# EAGLE design Adafruit OLED 128x32 Mono I2C STEMMA QT rev B (EAGLE 9.3.2)
COMPANY: ADAFRUIT INDUSTRIES; DRAWN: KTOWN; REV: A
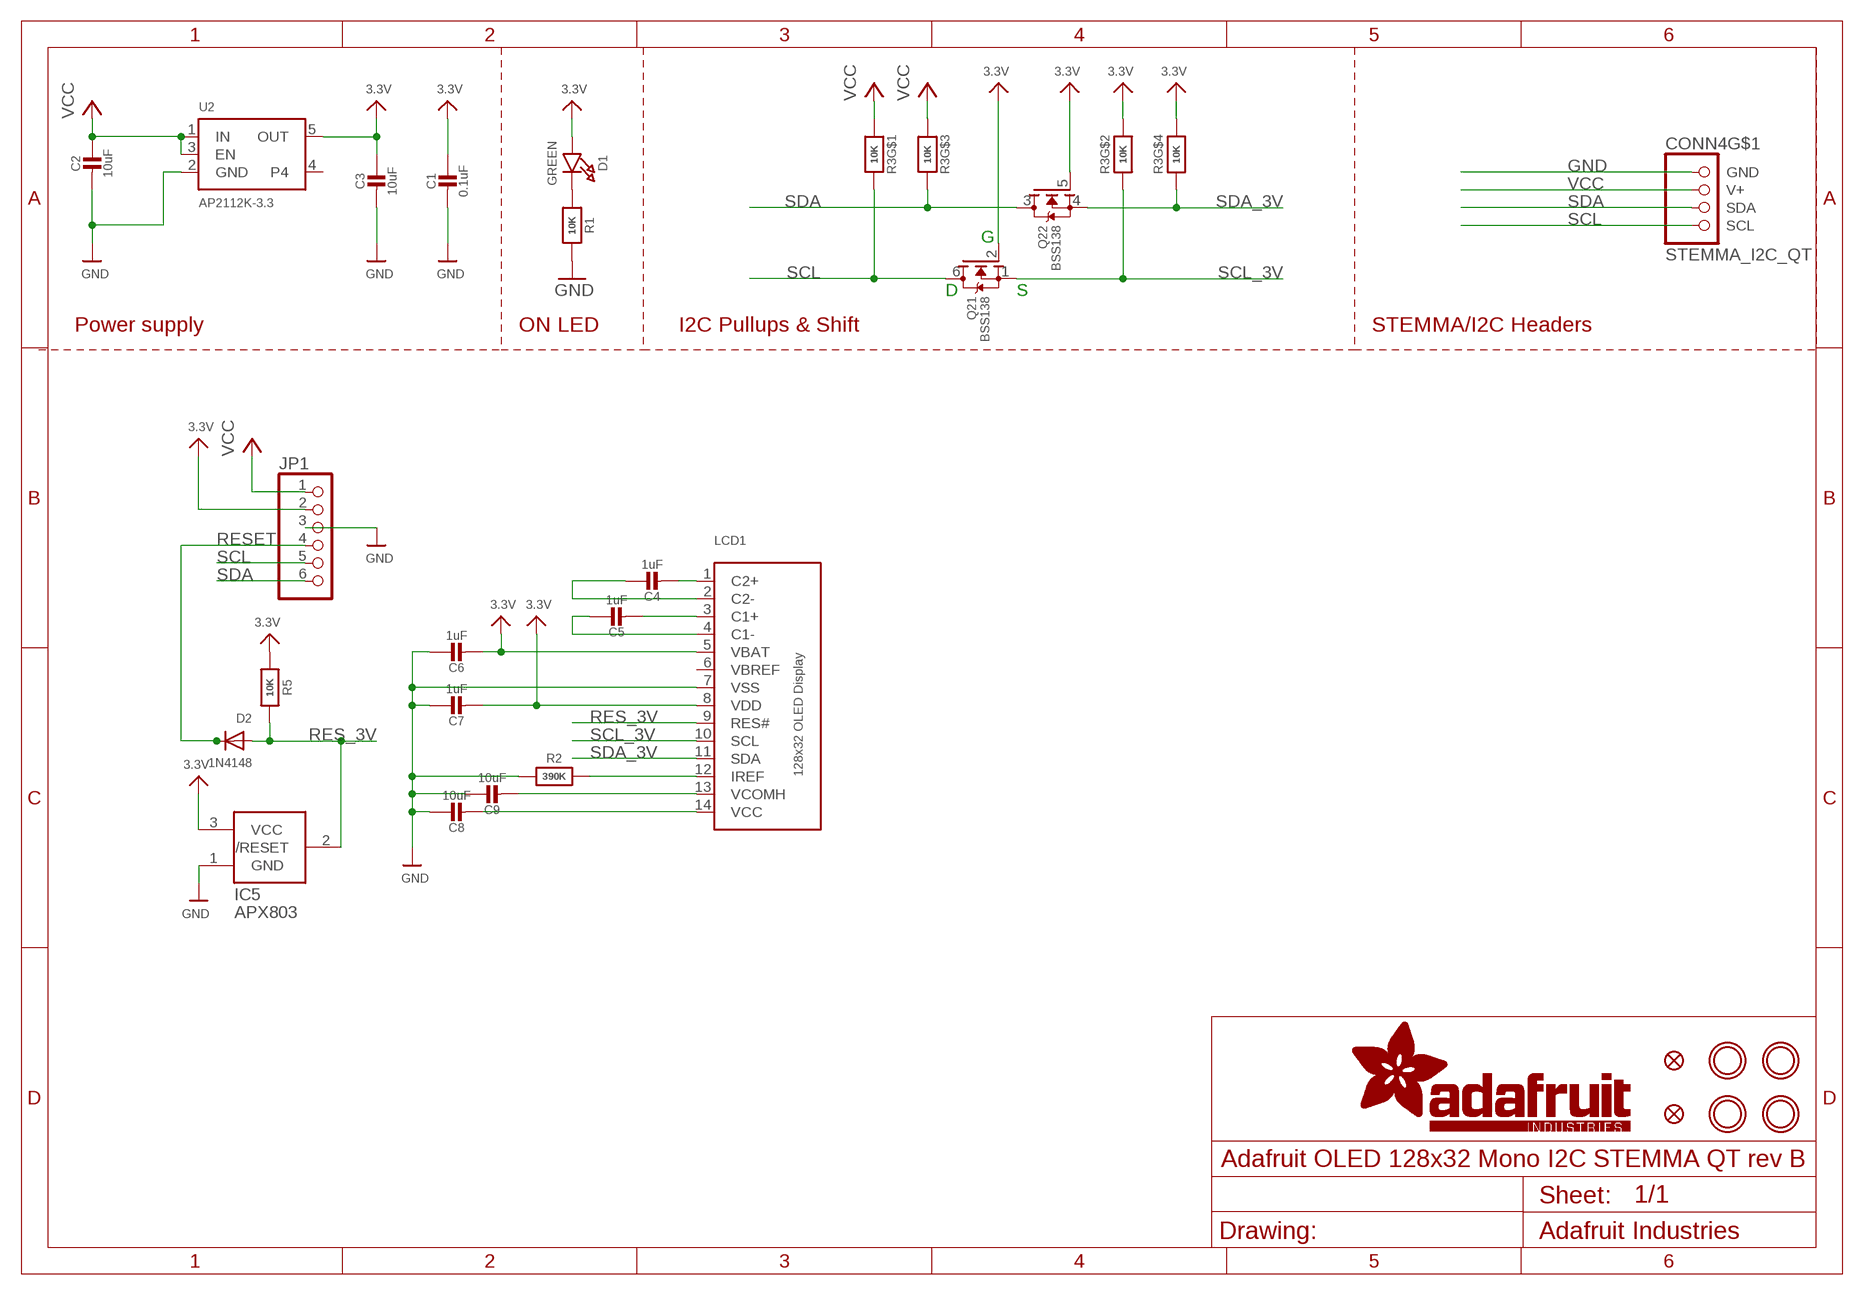
[diagram p0: schematic, sheet 1]

## Parts
C1  0.1uF  CAP_CERAMIC0603_NO  [0603-NO]
C2  10uF  CAP_CERAMIC0805-NOOUTLINE  [0805-NO]
C3  10uF  CAP_CERAMIC0805-NOOUTLINE  [0805-NO]
C4  1uF  CAP_CERAMIC0805-NOOUTLINE  [0805-NO]
C5  1uF  CAP_CERAMIC0805-NOOUTLINE  [0805-NO]
C6  1uF  CAP_CERAMIC0805-NOOUTLINE  [0805-NO]
C7  1uF  CAP_CERAMIC0805-NOOUTLINE  [0805-NO]
C8  10uF  CAP_CERAMIC0805-NOOUTLINE  [0805-NO]
C9  10uF  CAP_CERAMIC0805-NOOUTLINE  [0805-NO]
CONN4  STEMMA_I2C_QT  [JST_SH4]
D1  GREEN  LED0603_NOOUTLINE  [CHIPLED_0603_NOOUTLINE]
D2  1N4148  DIODESOD-323F  [SOD-323F]
FID3  FIDUCIAL_1MM  [FIDUCIAL_1MM]
FID4  FIDUCIAL_1MM  [FIDUCIAL_1MM]
IC5  APX803  AXP083-SAG  [SOT23]
JP1  HEADER-1X670MIL  [1X06_ROUND_70]
LCD1  DISP_OLED_UG-2832HSWEG02  [UG-2832HSWEG02_WRAPUNDER]
Q2  BSS138  MOSFET-N_DUAL  [SOT363]
R1  10K  RESISTOR_0603_NOOUT  [0603-NO]
R2  390K  RESISTOR_0603_NOOUT  [0603-NO]
R3  10K  RESISTOR_4PACK  [RESPACK_4X0603]
R5  10K  RESISTOR_0603_NOOUT  [0603-NO]
U2  AP2112K-3.3  VREG_SOT23-5  [SOT23-5]
U$1  MOUNTINGHOLE2.5  [MOUNTINGHOLE_2.5_PLATED]
U$17  MOUNTINGHOLE2.5  [MOUNTINGHOLE_2.5_PLATED]
U$19  MOUNTINGHOLE2.5  [MOUNTINGHOLE_2.5_PLATED]
U$21  MOUNTINGHOLE2.5  [MOUNTINGHOLE_2.5_PLATED]

## Nets
3.3V: C1.1 C3.1 C6.2 C7.2 D1.A IC5.3(VCC) JP1.2 LCD1.5(VBAT) LCD1.8(VDD) Q2.2(1:G) Q2.5(2:G) R3.2 R3.4 R5.2 U2.5(OUT)
GND: C1.2 C2.2 C3.2 C6.1 C7.1 C8.1 C9.1 CONN4.1(GND) IC5.1(GND) JP1.3 LCD1.7(VSS) R1.2 R2.1 U2.2(GND)
N$1: C4.2 LCD1.1(C2+)
N$2: D1.C R1.1
N$3: C4.1 LCD1.2(C2-)
N$4: C5.2 LCD1.3(C1+)
N$5: C5.1 LCD1.4(C1-)
N$6: C9.2 LCD1.13(VCOMH)
N$7: LCD1.12(IREF) R2.2
N$8: C8.2 LCD1.14(VCC)
RES_3V: D2.A IC5.2(/RESET) LCD1.9(RES#) R5.1
RESET: D2.C JP1.4
SCL: CONN4.4(SCL) JP1.5 Q2.6(1:D) R3.8
SCL_3V: LCD1.10(SCL) Q2.1(1:S) R3.7
SDA: CONN4.3(SDA) JP1.6 Q2.3(2:D) R3.6
SDA_3V: LCD1.11(SDA) Q2.4(2:S) R3.5
VCC: C2.1 CONN4.2(V+) JP1.1 R3.1 R3.3 U2.1(IN) U2.3(EN)
Unconnected: CONN4.MT1(MT) CONN4.MT2(MT) U2.4

## Notes on the sheet
- G
- D | S
- Power supply | ON LED | I2C Pullups & Shift | STEMMA/I2C Headers

## Power pins joined to a net without a drawn wire
VBREF: LCD1.6(VBREF)

## Library data of the parts
C1-C9 = microbuilder:CAP_CERAMIC: Ceramic Capacitors For new designs, use the packages preceded by an '_' character since they are more reliable: The following footprints should be used on most boards: _0402 - Standard footprint for regular board layouts _0603 - Standard footprint for regular board layouts _0805 - Standard footprint for regular board layouts _1206 - Standard footprint for regular board layouts For extremely tight-pitch boards where space is at a premium, the following 'micro-pitch' footprints can be used (smaller pads, no silkscreen outline, etc.): _0402MP - Micro-pitch footprint for very dense/compact boards _0603MP - Micro-pitch footprint for very dense/compact boards _0805MP - Micro-pitch footprint for very dense/compact boards _1206MP - Micro-pitch footprint for very dense/compact boards
CONN4 = microbuilder:STEMMA_I2C
D1 = microbuilder:LED: LED 0603 - 0603 Surface Mount Package 2mA: Green LED - Low Power (3.9mcd, 2ma, 1.7Vf) - Digikey: 475-2709-2-ND Orange LED - Low Power (9.8mcd, 2ma, 1.8Vf) - Digikey: 475-1194-2-ND Red LED - Low Power (5mcd, 2ma, 1.8Vf) - Digikey: 475-1195-2-ND Yellow LED - Low Power (7mcd, 2ma, 1.8Vf) - Digikey: 475-1196-2-ND 5mA: Blue LED - Low Power (17mcd, 5ma, 2.9Vf) - Digikey: LNJ937W8CRACT-ND 0805 - 0805 Surface Mount Package 2mA: Red LED (8.8mcd, 2mA, 1.8Vf, Clear) - Low Power [Digikey: 475-2510-1-ND] Green LED (5mcd, 2mA, 1.8Vf, Clear) - Low Power [Digikey: 475-2730-1-ND] Yellow LED (11.3mcd, 2mA, 1.8Vf, Clear) - Low Power [Digikey: 475-2555-1-ND] 20mA: Red LED (104mcd, 20mA, Diffused) - LS R976 [Digikey: 475-1278-6-ND] Red LED (12mcd, 20mA, 2.0Vf, Clear) - APT2012EC [Digikey: 754-1128-1-ND] Green LED (15mcd, 20mA, 2.2Vf, Clear) - APT2012GC [Digikey: 754-1131-1-ND] Orange LED (160mcd, 20mA, 2.1Vf, Clear) - APT2012SECK [Digikey: 754-1130-1-ND] 1206 - 1206 Surface Mount Package Green LED (26mcd, 20mA, Diffused) - LG N971 [Digikey: 475-1407-6-ND] Red LED (15mcd, 20mA, Diffused) - LH N974 [Digikey: 475-1416-6-ND] Cree - Cree High-Power Surface Mount LEDs XPEBWT-L1-0000-00D50 - White 111lm 350mA 2.9Vf 6200K 110° XTEAWT-00-0000-00000LEE3 - White 114lm 350mA 2.85Vf 5000K 115° Everlight - Everlight 45-21 Series Surface Mount LEDs 45-21/QK2C-B2832AC2CB2/2T - Warm White 2000mcd 20mA 3.25Vf 3050K 120° 45-21/LK2C-B38452C4CB2/2T - Nuetral White 2000mcd 20mA 3.25Vf 4150K 120° 45-21/LK2C-B50634C6CB2/2T - Cold White 2200mcd 20mA 3.25Vf 5650K 120° PLCC2 Reverse Mount LS T77K-J1L2-1-0-2-R18-Z - Red 11.25mcd 2mA 1.8Vf 630nm 120° LO T77K-L1M2-24-Z - Orange 19.6mcd 2mA 1.8Vf 606nm 120° LY T77K-K2M1-26-Z - Yellow 15.7mcd 2mA 1.8Vf 587nm 120°
D2 = adafruit:DIODE: Diode SMADIODE - SMA Surface Mount Package 20V 1A Schottky Diode Digikey: 641-1014-6-ND DO-1N4148 - Through Hole Small Current Diode SOD-123 20V 1 A (.5mV Vf) Schottky Diode - Digikey: MBRX120TPMSCT-ND SOD-323 10V 570mA (.38mV Vf, 3ns) Schottky Diode - Digikey: ZLLS410CT-ND SOD-523 30V 30mA Schottky Diode (RB751S-40TE61) - Digikey: RB751S-40TE61CT-ND SOT23-R/W - SOT23 Package (R = Solder Paste/Reflow Ovens, W = Hand-Soldering) BAT54Film 40V 300mA - Digikey: 497-7162-1-ND
FID3 FID4 = microbuilder:FIDUCIAL: Fiducial Alignment Points Various fiducial points for machine vision alignment.; BOM: EXCLUDE
IC5 = adafruit:AXP083
JP1 = microbuilder:HEADER-1X6: PIN HEADER
LCD1 = microbuilder:DISP_OLED_UG-2832HSWEG02: 128x32 I2C 0.91" Monochrome OLED Display
Q2 = microbuilder:MOSFET-N_DUAL: Dual N-Channel MOSFET SOT363 (2.0x1.25mm) 2N7002PS - 60V, 320mA [Digikey: 568-5984-1-ND]
R1 R2 R5 = microbuilder:RESISTOR: Resistors For new designs, use the packages preceded by an '_' character since they are more reliable: The following footprints should be used on most boards: _0402 - Standard footprint for regular board layouts _0603 - Standard footprint for regular board layouts _0805 - Standard footprint for regular board layouts _1206 - Standard footprint for regular board layouts For extremely tight-pitch boards where space is at a premium, the following 'micro-pitch' footprints can be used (smaller pads, no silkscreen outline, etc.): _0402MP - Micro-pitch footprint for very dense/compact boards _0603MP - Micro-pitch footprint for very dense/compact boards _0805MP - Micro-pitch footprint for very dense/compact boards _1206MP - Micro-pitch footprint for very dense/compact boards
R3 = microbuilder:RESISTOR_4PACK: Resistor Packs (4 resistors) 4 x 0603 10K 1/16W - Digikey: YC164J-10KCT-ND
U2 = microbuilder:VREG_SOT23-5: SOT23-5 Fixed Voltage Regulators Part Current Out V Out V In V Dropout θJA (°C/W) TJ (°C) Digikey Part No. ADP121 150mA 3.3V 3.4-5.5V 0.09V @ 150mA -- -- ADP121-AUJZ33R7CT-ND ADP121 150mA 3.0V 3.1-5.5V 0.09V @ 150mA -- -- ADP121-AUJZ30R7CT-ND ADP122 300mA 3.3V 3.4-5.5V 0.085V @ 300mA -- -- ADP122AUJZ-3.3-R7CT-ND ADP1712 300mA 3.3V 3.5-5.5V 0.17V @ 300mA -- -- ADP1712AUJZ-3.3-R7TR-ND AP7311 (Low Cost) 150mA 3.3V 3.5-6V 0.15V @ 150mA -- -- AP7311-33WG-7DICT-ND LD39015M18R 150mA 1.8V 1.9V-5.5V 0.08V @ 100mA -- -- 497-6977-1-ND LP2985A-33DBVR 150mA 3.3V 3.3-16V 0.28V @ 150mA 206 150 296-18479-1-ND MCP1824T-3302E/OT 300mA 3.3V 3.5V-6V 0.2V @ 300mA -- -- MCP1824T-3302E/OTCT-ND MIC5205-2.5YM5 TR 150mA 2.5V 2.7-16V 0.165V @ 150mA -- -- 576-1257-2-ND MIC5205-3.0YM5 TR 150mA 3.0V 3.2V-16V 0.165V @ 150mA -- -- 576-1258-2-ND MIC5205-3.3YM5 TR 150mA 3.3V 3.5V-16V 0.165V @ 150mA -- -- 576-1259-2-ND TPS780330220 150mA 3.3V+2.2V 3.6-5.5V 250mV Max -- -- 296-23332-1-ND TDA3663/N1,135 100mA 3.3V 3.5-45V 0.18V @ 50mA -- -- 568-5343-1-ND Max operating temp can be calculated using θJA, TJ (max junction temperature), and power in watts. Set the "Maximum Ambient Temperature" until it reaches TJ ("Max Junction Temperature"), which is the absolute limit for safe use of the regulator: Heat Sink Temperature Calculator <http://www.daycounter.com/Calculators/Heat-Sink-Temperature-Calculator.phtml> For example, With 12V source into a 3.3V LP2985 and a 30mA load, we are dissipating (12V-3.3V) * 0.03A = 0.261W. With a θJA of 206 °C/W, a TJ of 150°C, and 261mW we can safely use the chip without a heat sink up to 75°C (=147.1°C Junction Temperature).
U$1 U$17 U$19 U$21 = microbuilder:MOUNTINGHOLE: Mounting Hole For #2 screws (0.086"/2.18mm width, 0.094"/2.4mm hole) use 2.5mm; BOM: EXCLUDE

## Board
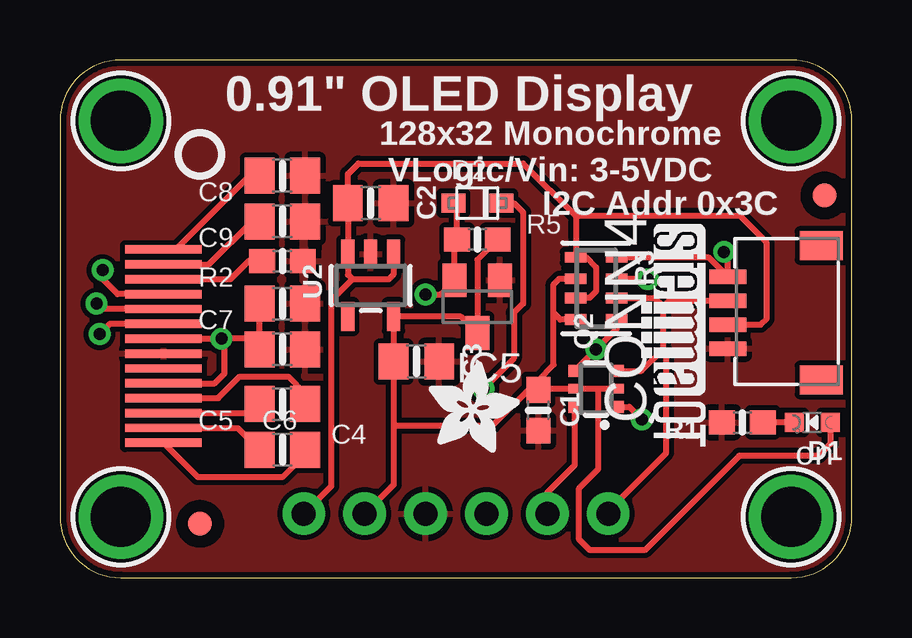
[diagram p1: board, top side]
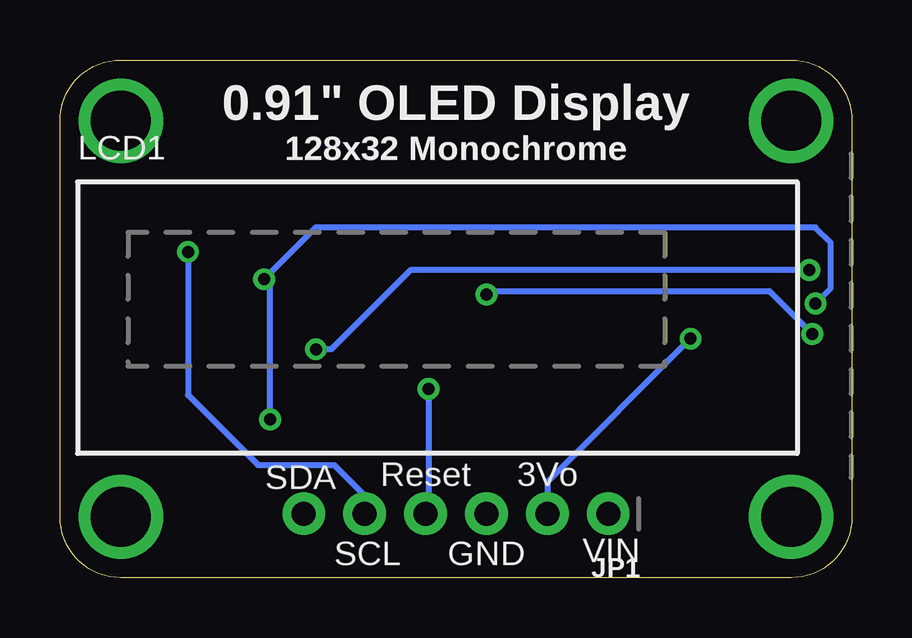
[diagram p2: board, bottom side, seen from below]

Size 33.02 x 21.59 mm. Coordinates in mm from the lower left corner, seen from the top.
Outline: 33.02,2.54 33.02,19.05 arc90 30.48,21.59 2.54,21.59 arc90 0,19.05 0,2.54 arc90 2.54,0 30.48,0 arc90 33.02,2.54
Copper layers (1*16): Top 0.035mm / dielectric 1.5mm / Bottom 0.035mm
Design rules "adafruit *": minimum track width 8mil, minimum drill 15.5mil, track to track 8mil, track to pad 8mil, pad to pad 8mil, via to via 8mil, smd to smd 8mil, copper to edge 10mil, drill to drill 8mil, minimum pad ring 10mil, minimum via ring 8mil, stop-mask expansion 2mil, vias tented up to drill 20mil, thermal gap 10mil

### Footprints (pad centres in the part's own frame; a part is rotated, then mirrored left to right if it is on the bottom)
0603-NO = smd 1.075 x 1: 1 -0.85,0; 2 0.85,0
0805-NO = smd 1.24 x 1.5: 1 -0.95,0; 2 0.95,0
JST_SH4 = smd 0.6 x 1.55: 1 -1.5,2.514; 2 -0.5,2.514; 3 0.5,2.514; 4 1.5,2.514 | smd 1.2 x 1.8: MT1 -2.8,-1.386; MT2 2.8,-1.386
CHIPLED_0603_NOOUTLINE = smd 0.8 x 0.8: A 0,-0.75; C 0,0.75
SOD-323F = smd 1 x 0.8: A -1,0; C 1,0
FIDUCIAL_1MM = smd 1 x 1: 1 0,0
SOT23 = smd 1 x 1.4: 1 -0.95,-1.1; 2 0.95,-1.1; 3 0,1.1
1X06_ROUND_70 = drill 1 pad 1.778: 1 -6.35,0; 2 -3.81,0; 3 -1.27,0; 4 1.27,0; 5 3.81,0; 6 6.35,0
UG-2832HSWEG02_WRAPUNDER = smd 3.2 x 0.35 bottom: 1 -2.03,-5.3; 2 -2.03,-4.68; 3 -2.03,-4.06; 4 -2.03,-3.44; 5 -2.03,-2.82; 6 -2.03,-2.2; 7 -2.03,-1.58; 8 -2.03,-0.96; 9 -2.03,-0.34; 10 -2.03,0.28; 11 -2.03,0.9; 12 -2.03,1.52; 13 -2.03,2.14; 14 -2.03,2.76
SOT363 = smd 0.5 x 0.5: 1 -0.75,-0.9; 3 0.75,-0.9; 4 0.75,0.9; 6 -0.75,0.9 | smd 0.4 x 0.5: 2 0,-0.9; 5 0,0.9
RESPACK_4X0603 = smd 0.45 x 0.9: 1 -1.3,-0.85; 2 -0.4,-0.85; 3 0.4,-0.85; 4 1.3,-0.85; 5 1.3,0.85; 6 0.4,0.85; 7 -0.4,0.85; 8 -1.3,0.85
SOT23-5 = smd 0.55 x 1.2: 1 -0.95,-1.3; 2 0,-1.3; 3 0.95,-1.3; 4 0.95,1.3; 5 -0.95,1.3
MOUNTINGHOLE_2.5_PLATED = drill 2.5 pad 3.2: P$1 0,0

### Placement (x,y rotation side)
C1  19.94,6.98 270 top
C2  12.95,15.62 0 top
C3  14.86,9.02 0 top
C4  9.27,5.33 0 top
C5  9.27,7.24 180 top
C6  9.27,9.53 180 top
C7  9.27,11.43 180 top
C8  9.27,16.76 180 top
C9  9.27,14.86 180 top
CONN4  30.35,11.05 90 top
D1  31.37,6.48 90 top
D2  17.4,15.62 0 top
FID3  31.88,15.94 180 top
FID4  5.84,2.25 180 top
IC5  17.4,11.3 180 top
JP1  16.51,2.67 180 bottom
LCD1  2.29,10.93 0 bottom
Q2  22.35,7.87 90 top
R1  28.45,6.48 180 top
R2  9.27,13.21 180 top
R3  22.35,12.07 270 top
R5  17.4,14.1 0 top
U2  12.95,12.19 180 top
U$1  30.48,2.54 180 top
U$17  2.54,2.54 180 top
U$19  30.48,19.05 180 top
U$21  2.54,19.05 180 top
U$22  [ADAFRUIT_3.5MM]  15.37,5.21 0 top
U$25  [PCBFEAT-REV-040]  5.84,17.65 180 top
U$31  [STEMMAQT]  24.26,14.73 270 top

### Tracks (layer width: path | path; a pad name or v marks a point on that pad's centre or on a via)
3.3V  (via drill 0.5)
  Top 0.254: C6.2 8.32,9.91 | 8.32,9.91 C7.2 | LCD1.8 v6.73,9.97 6.86,9.97 | 8.32,9.91 8.26,9.97 6.86,9.97 | R5.2 17.4,13.25 IC5.3 16.71,10.89 U2.5 C3.1 13.91,6.35 | R3.2 20.81,12.46 20.57,12.23 20.57,11.05 | R3.4 20.86,10.77 20.57,11.05 | Q2.2 22.35,7.87 | 22.35,7.87 Q2.5 20.45,7.87 20.32,7.87 | 22.35,7.87 22.44,7.79 22.44,4.53 21.64,3.73 21.64,1.6 22.1,1.14 24.38,1.14 28.32,5.08 31.62,5.08 32.12,5.58 D1.A | 13.91,6.35 13.91,3.88 JP1.2 | 20.32,7.87 19.94,8.26 | 20.57,11.05 20.57,8.89 19.94,8.26 | 13.91,6.35 18.03,6.35 19.94,8.26 | LCD1.5 6.46,8.11 6.86,8.51 6.86,9.97 | C1.1 19.98,7.87 20.32,7.87
  Bottom 0.254: v6.73,9.97 12.7,4 JP1.2
GND
  pour Top: 0,21.84 33.02,21.84 33.02,0.13 0,0.13
N$1
  Top 0.254: LCD1.1 5.75,4.19 9.27,4.19 10.22,5.14 C4.2
N$2
  Top 0.254: D1.C R1.1
N$3
  Top 0.254: LCD1.2 7.41,6.25 C4.1
N$4
  Top 0.254: LCD1.3 7.95,6.87 C5.2
N$5
  Top 0.254: LCD1.4 6.6,7.49 7.49,8.38 9.53,8.38 10.22,7.69 C5.1
N$6
  Top 0.254: LCD1.13 6.21,13.07 8,14.86 C9.2
N$7
  Top 0.254: LCD1.12 7.11,12.45 7.87,13.21 R2.2
N$8
  Top 0.254: LCD1.14 4.82,13.69 7.9,16.76 C8.2
RES_3V  (via drill 0.5)
  Top 0.254: D2.A 16.55,15.47 R5.1 16.45,14 IC5.2 15.86,11.81 v15.24,11.81 | LCD1.9 2.08,10.59 v1.65,10.16
  Bottom 0.254: v1.65,10.16 3.43,11.94 15.11,11.94 v15.24,11.81
RESET  (via drill 0.5)
  Top 0.254: D2.C 18.92,15.62 19.3,15.24 19.3,11.43 18.92,11.05 18.92,9.14 v17.65,7.87
  Bottom 0.254: v17.65,7.87 17.65,2.79 JP1.4
SCL  (via drill 0.5)
  Top 0.254: R3.8 27.02,13.37 CONN4.4 27.84,13.44 v27.69,13.59 | JP1.5 20.32,3.56 21.45,4.69 Q2.6
  Bottom 0.254: v27.69,13.59 27.69,7.62 24.77,4.7 21.59,4.7 20.32,3.43 JP1.5
SCL_3V  (via drill 0.5)
  Top 0.254: Q2.1 23.74,7.12 v24.26,6.6 | v24.51,12.45 24.49,12.46 R3.7 | LCD1.10 1.88,11.21 1.65,11.43 v1.52,11.43
  Bottom 0.254: v24.26,6.6 24.26,12.19 v24.51,12.45 22.35,14.61 1.52,14.61 0.89,13.97 0.89,12.07 v1.52,11.43
SDA
  Top 0.254: Q2.3 24.25,8.62 25.15,9.53 | 25.15,9.53 25.15,11.3 | CONN4.3 25.39,11.55 25.15,11.3 | R3.6 24.78,11.67 25.15,11.3 | JP1.6 22.86,2.79 25.27,5.21 25.27,9.4 25.15,9.53
SDA_3V  (via drill 0.5)
  Top 0.254: Q2.4 v22.35,9.53 23.2,10.37 R3.5 | LCD1.11 2.4,11.83 1.78,12.45 v1.78,12.83
  Bottom 0.254: v1.78,12.83 18.41,12.83 21.72,9.53 v22.35,9.53
VCC
  Top 0.254: U2.1 13.9,12.63 13.72,12.45 12.19,12.45 | 12.19,12.45 12,12.63 U2.3 C2.1 12,16.83 12.45,17.27 19.3,17.27 21.5,15.07 | R3.3 22.08,11.67 22.35,11.94 22.35,12.95 21.94,13.37 R3.1 21.5,15.07 | CONN4.2 29.22,10.55 29.46,10.79 29.46,13.97 28.36,15.07 21.5,15.07 | 12.19,12.45 11.3,11.56 11.3,3.81 JP1.1

### Text on the board
tPlace: 0.91" OLED Display | 128x32 Monochrome / VLogic/Vin: 3-5VDC | I2C Addr 0x3C | on
bPlace: 0.91" OLED Display | 128x32 Monochrome | 3Vo | Reset | SDA | VIN | GND | SCL